# Altium schematic sheet SmartHome V3.SchDoc
size A2
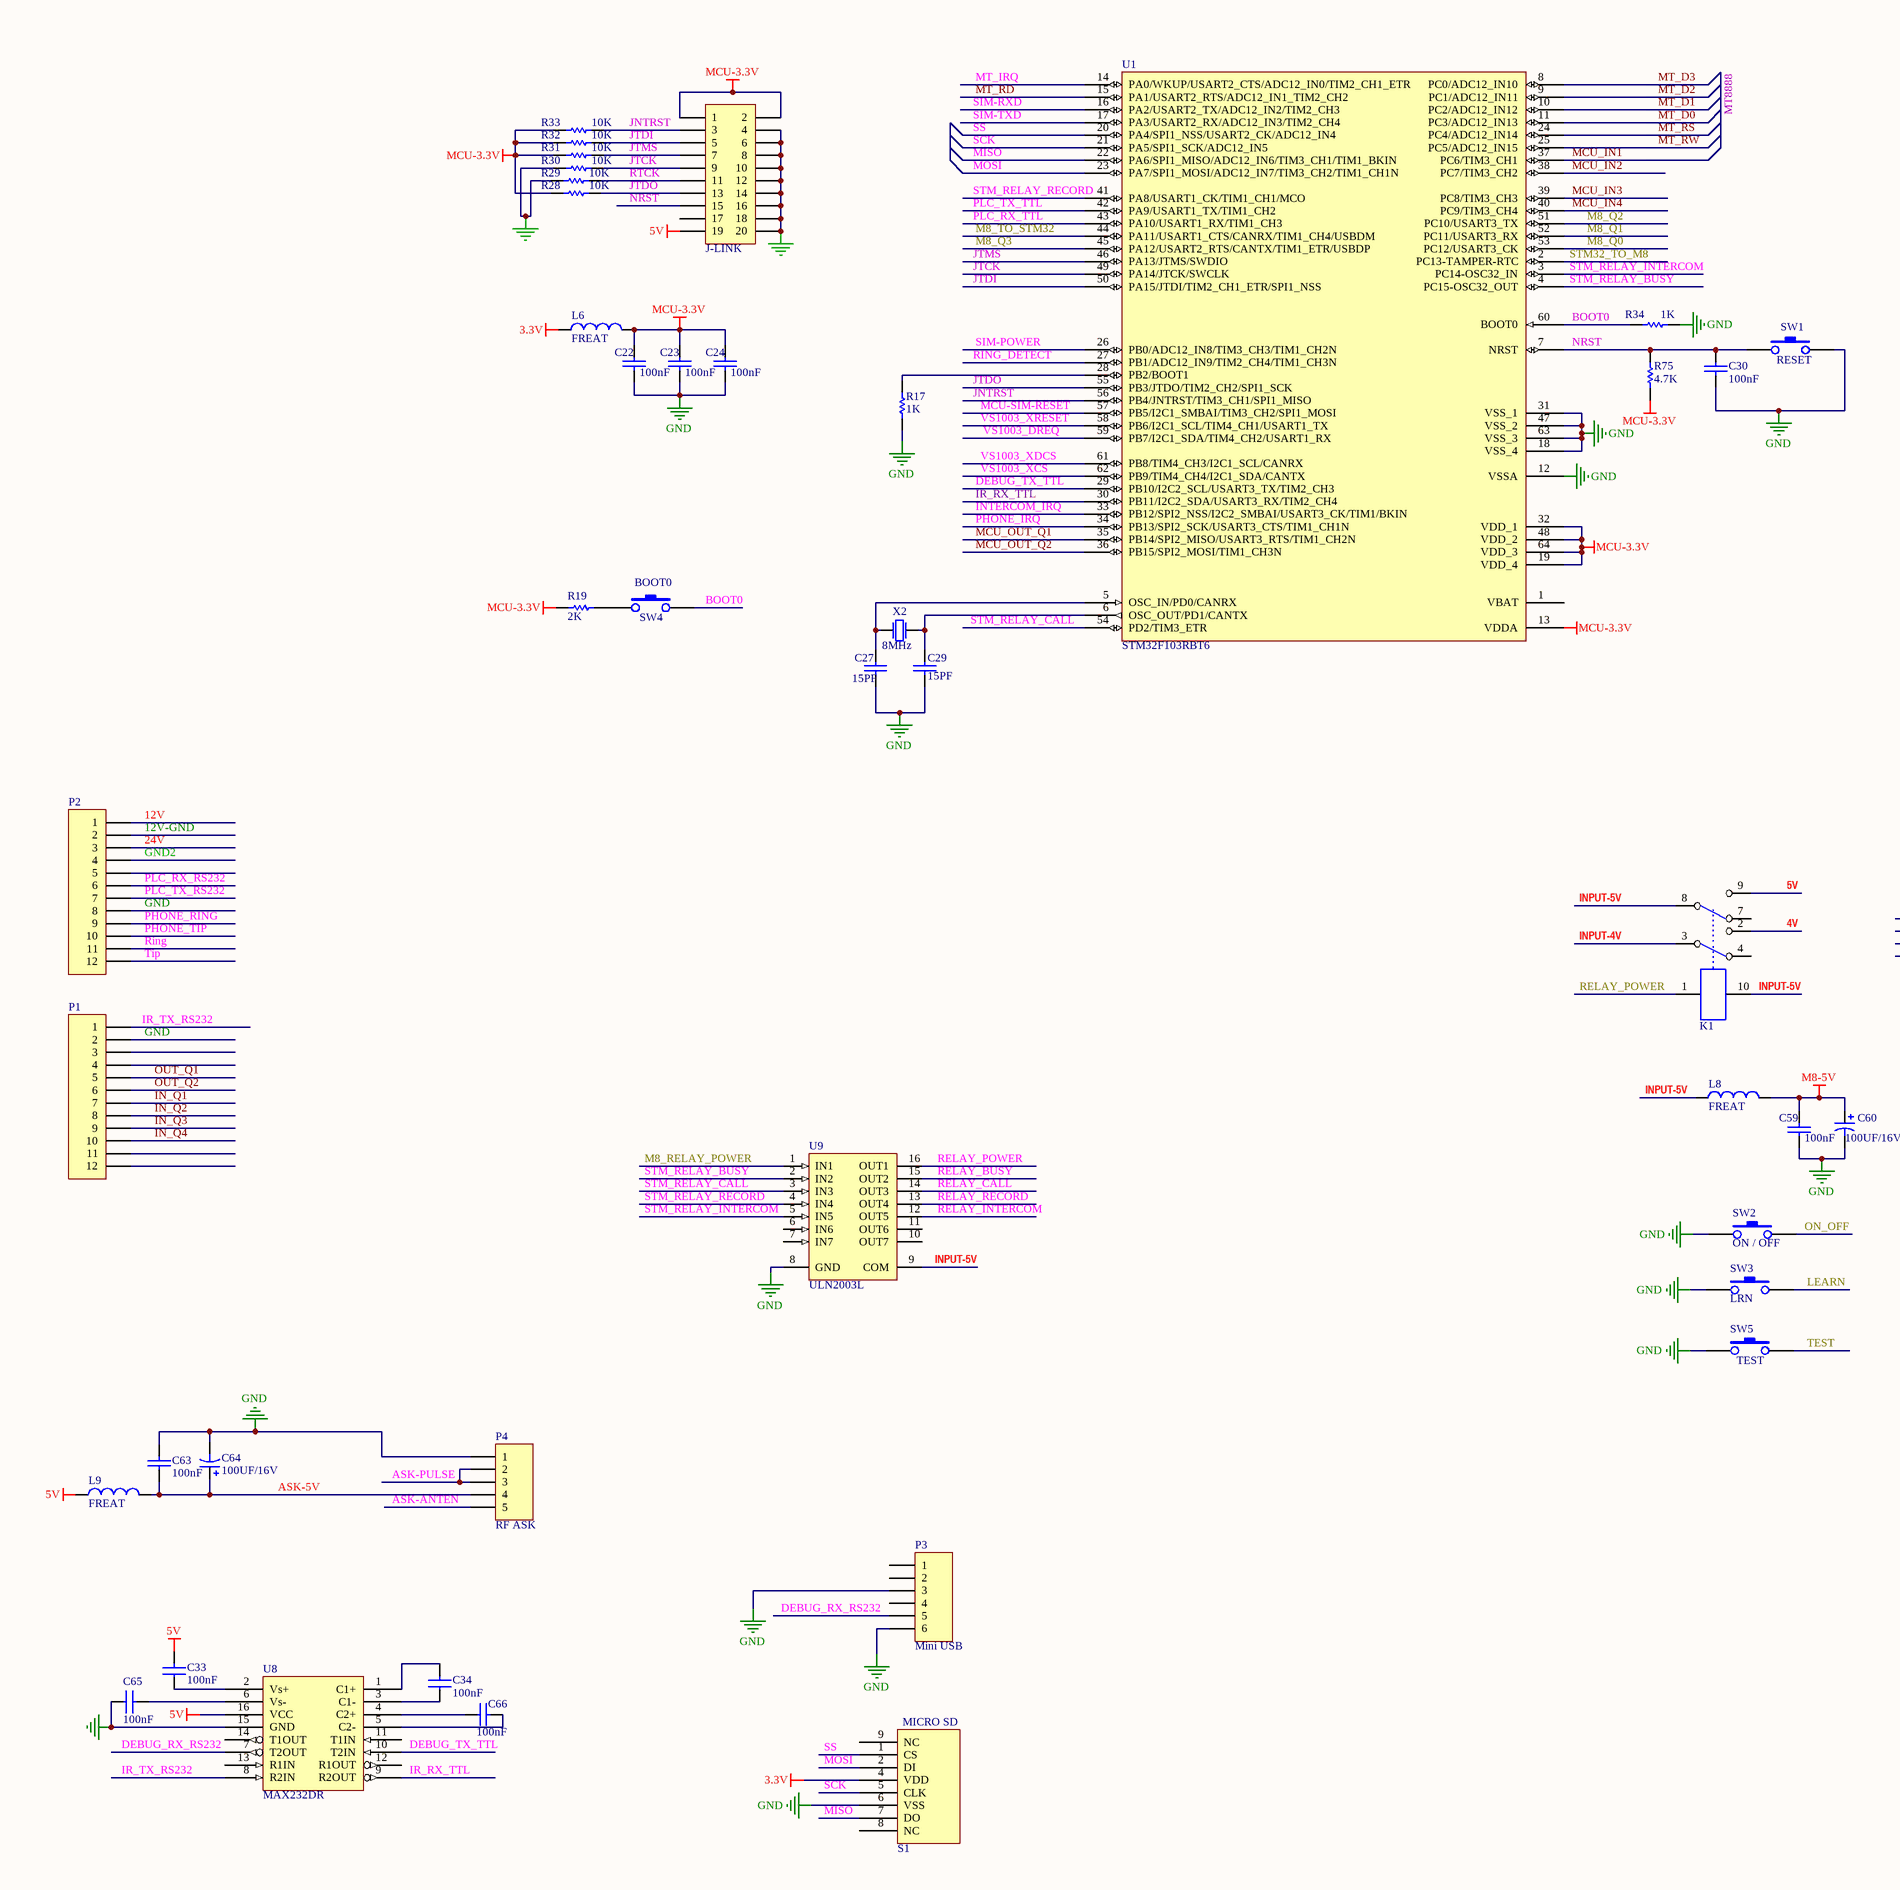
[diagram p0: SmartHome V3.SchDoc, left]
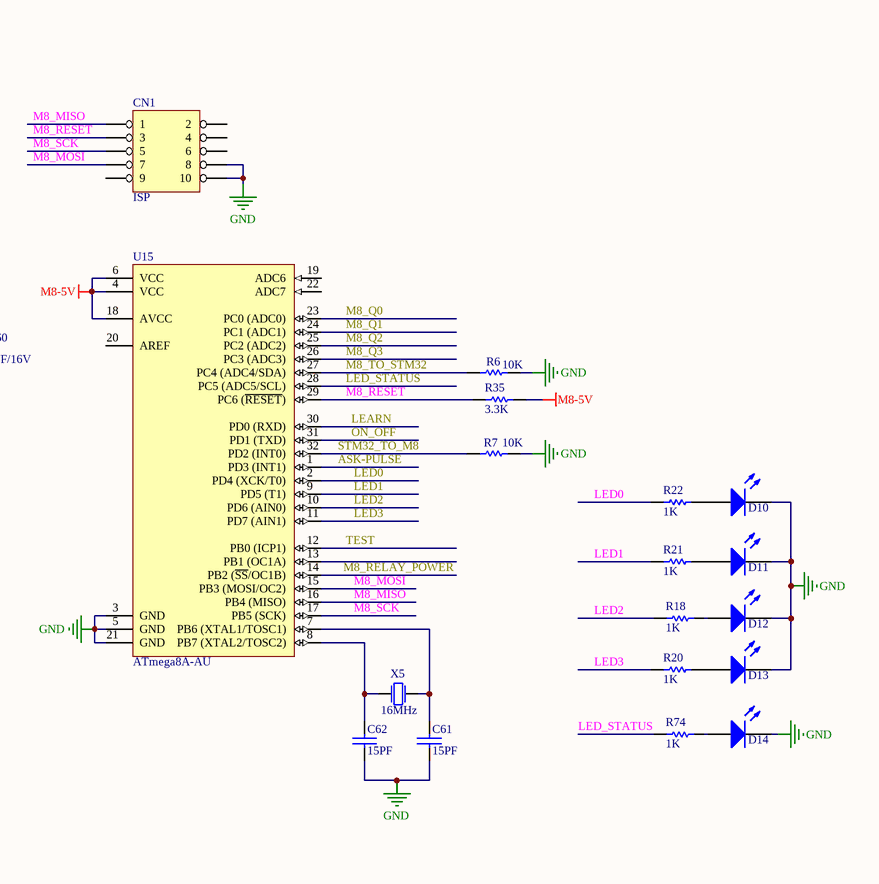
[diagram p1: SmartHome V3.SchDoc, right]

## Parts
C22  100nF  [0805C]
C23  100nF  [0805C]
C24  100nF  [0805C]
C27  15PF  [0805c]
C29  15PF  [0805c]
C30  100nF  [0805C]
C33  100nF  [0805C]
C34  100nF  [0805c]
C59  100nF  [0805C]
C60  value 100UF/16V  [100UF-SMD]  (hidden comment: 100uF / 16V SMD)
C61  15PF  [0805c]
C62  15PF  [0805c]
C63  100nF  [0805C]
C64  value 100UF/16V  [100UF-SMD]  (hidden comment: 100uF / 16V SMD)
C65  100nF  [0805c]
C66  100nF  [0805c]
CN1  ISP  [IDC2.54-V10D]
D10  LED  [0805D]  (value not drawn)
D11  LED  [0805D]  (value not drawn)
D12  LED  [0805D]  (value not drawn)
D13  LED  [0805D]  (value not drawn)
D14  LED  [0805D]  (value not drawn)
J-LINK  IDC 20  [IDC2.54-V20D]  (value not drawn)
K1  RELAY 5V  [RELAY G6H]  (value not drawn)
L6  FREAT  [1206]
L8  FREAT  [1206]
L9  FREAT  [1206]
P1  FONIX-12  [Fonit_Conector]  (value not drawn)
P2  FONIX-12  [Fonit_Conector]  (value not drawn)
P3  Mini USB  [miniusb]
P4  RF ASK  [ASK-RF]
R6  10K  [0805]
R7  10K  [0805]
R17  value 1K  [0805]  (hidden comment: 10K)
R18  1K  [0805]
R19  value 2K  [0805]  (hidden comment: 10K)
R20  1K  [0805]
R21  1K  [0805]
R22  1K  [0805]
R28  10K  [0805]
R29  10K  [0805]
R30  10K  [0805]
R31  10K  [0805]
R32  10K  [0805]
R33  10K  [0805]
R34  1K  [0805]
R35  3.3K  [0805]
R74  1K  [0805]
R75  4.7K  [0805]
S1  MICRO SD  [MicroSD]
SW1  SWITCH  [SWICH]  (value not drawn)
SW2  SWITCH  [SWICH]  (value not drawn)
SW3  SWITCH  [SWICH]  (value not drawn)
SW4  SWITCH  [SWICH]  (value not drawn)
SW5  SWITCH  [SWICH]  (value not drawn)
U1  STM32F103RBT6  [LQFP64_L]
U8  MAX232DR  [L16_N]
U9  ULN2003L  [L16_N]
U15  ATmega8A-AU  [32A_N]
X2  8MHz  [crystal]
X5  16MHz  [crystal]

## Nets
3.3V: L6.2 S1.4(VDD)
5V: C33.2 J-LINK.19 K1.9(NO2) L9.1 U8.16(VCC)
GND: C22.2 C23.2 C24.2 C27.2 C29.2 C30.2 C59.2 C60.2 C61.2 C62.2 C63.2 C64.2 C65.1 CN1.8 CN1.10 D10.2(K) D11.2(K) D12.2(K) D13.2(K) D14.2(K) J-LINK.4 J-LINK.6 J-LINK.8 J-LINK.10 J-LINK.12 J-LINK.14 J-LINK.16 J-LINK.18 J-LINK.20 P1.2 P2.8 P3.3 P3.6 P4.1 R6.2 R7.2 R17.1 R29.2 R30.2 R34.2 S1.6(VSS) SW1.2 SW2.2 SW3.2 SW5.2 U1.12(VSSA) U1.18(VSS_4) U1.31(VSS_1) U1.47(VSS_2) U1.63(VSS_3) U8.15(GND) U9.8(GND) U15.3(GND) U15.5(GND) U15.21(GND)
M8-5V: C59.1 C60.1 L8.1 R35.2 U15.4(VCC) U15.6(VCC) U15.18(AVCC)
MCU-3.3V: C22.1 C23.1 C24.1 J-LINK.1 J-LINK.2 L6.1 R19.2 R28.2 R31.2 R32.2 R33.2 R75.2 U1.13(VDDA) U1.19(VDD_4) U1.32(VDD_1) U1.48(VDD_2) U1.64(VDD_3)
4V: K1.2(NO1)
12V: P2.1
12V-GND: P2.2
24V: P2.3
ASK-5V: C63.1 C64.1 L9.2 P4.4
ASK-ANTEN: P4.5
ASK-PULSE: P4.2 P4.3 U15.1(PD3_(INT1))
BOOT0: R34.1 SW4.1 U1.60(BOOT0)
DEBUG_RX_RS232: P3.5 U8.7(T2OUT)
DEBUG_TX_TTL: U1.29(PB10/I2C2_SCL/USART3_TX/TIM2_CH3) U8.10(T2IN)
GND2: P2.4
IN_Q1: P1.7
IN_Q2: P1.8
IN_Q3: P1.9
IN_Q4: P1.10
INPUT-4V: K1.3(C1)
INPUT-5V: K1.8(C2) K1.10(-) L8.2 U9.9(COM)
INTERCOM_IRQ: U1.33(PB12/SPI2_NSS/I2C2_SMBAI/USART3_CK/TIM1/BKIN)
IR_RX_TTL: U1.30(PB11/I2C2_SDA/USART3_RX/TIM2_CH4) U8.9(R2OUT)
IR_TX_RS232: P1.1 U8.8(R2IN)
JNTRST: J-LINK.3 R33.1 U1.56(PB4/JNTRST/TIM3_CH1/SPI1_MISO)
JTCK: J-LINK.9 R30.1 U1.49(PA14/JTCK/SWCLK)
JTDI: J-LINK.5 R32.1 U1.50(PA15/JTDI/TIM2_CH1_ETR/SPI1_NSS)
JTDO: J-LINK.13 R28.1 U1.55(PB3/JTDO/TIM2_CH2/SPI1_SCK)
JTMS: J-LINK.7 R31.1 U1.46(PA13/JTMS/SWDIO)
LEARN: SW3.1 U15.30(PD0_(RXD))
LED0: R22.1 U15.2(PD4_(XCK/T0))
LED1: R21.1 U15.9(PD5_(T1))
LED2: R18.1 U15.10(PD6_(AIN0))
LED3: R20.1 U15.11(PD7_(AIN1))
LED_STATUS: R74.1 U15.28(PC5_(ADC5/SCL))
M8_MISO: CN1.1 U15.16(PB4_(MISO))
M8_MOSI: CN1.7 U15.15(PB3_(MOSI/OC2))
M8_Q0: U1.53(PC12/USART3_CK) U15.23(PC0_(ADC0))
M8_Q1: U1.52(PC11/USART3_RX) U15.24(PC1_(ADC1))
M8_Q2: U1.51(PC10/USART3_TX) U15.25(PC2_(ADC2))
M8_Q3: U1.45(PA12/USART2_RTS/CANTX/TIM1_ETR/USBDP) U15.26(PC3_(ADC3))
M8_RELAY_POWER: U9.1(IN1) U15.14(PB2_(~{SS}/OC1B))
M8_RESET: CN1.3 R35.1 U15.29(PC6_(~{RESET}))
M8_SCK: CN1.5 U15.17(PB5_(SCK))
M8_TO_STM32: R6.1 U1.44(PA11/USART1_CTS/CANRX/TIM1_CH4/USBDM) U15.27(PC4_(ADC4/SDA))
MCU-SIM-RESET: U1.57(PB5/I2C1_SMBAI/TIM3_CH2/SPI1_MOSI)
MCU_IN1: U1.37(PC6/TIM3_CH1)
MCU_IN2: U1.38(PC7/TIM3_CH2)
MCU_IN3: U1.39(PC8/TIM3_CH3)
MCU_IN4: U1.40(PC9/TIM3_CH4)
MCU_OUT_Q1: U1.35(PB14/SPI2_MISO/USART3_RTS/TIM1_CH2N)
MCU_OUT_Q2: U1.36(PB15/SPI2_MOSI/TIM1_CH3N)
MISO: S1.7(DO) U1.22(PA6/SPI1_MISO/ADC12_IN6/TIM3_CH1/TIM1_BKIN)
MOSI: S1.2(DI) U1.23(PA7/SPI1_MOSI/ADC12_IN7/TIM3_CH2/TIM1_CH1N)
MT_D0: U1.11(PC3/ADC12_IN13)
MT_D1: U1.10(PC2/ADC12_IN12)
MT_D2: U1.9(PC1/ADC12_IN11)
MT_D3: U1.8(PC0/ADC12_IN10)
MT_IRQ: U1.14(PA0/WKUP/USART2_CTS/ADC12_IN0/TIM2_CH1_ETR)
MT_RD: U1.15(PA1/USART2_RTS/ADC12_IN1_TIM2_CH2)
MT_RS: U1.24(PC4/ADC12_IN14)
MT_RW: U1.25(PC5/ADC12_IN15)
NRST: C30.1 J-LINK.15 R75.1 SW1.1 U1.7(NRST)
ON_OFF: SW2.1 U15.31(PD1_(TXD))
OUT_Q1: P1.5
OUT_Q2: P1.6
PHONE_IRQ: U1.34(PB13/SPI2_SCK/USART3_CTS/TIM1_CH1N)
PHONE_RING: P2.9
PHONE_TIP: P2.10
PLC_RX_RS232: P2.6
PLC_RX_TTL: U1.43(PA10/USART1_RX/TIM1_CH3)
PLC_TX_RS232: P2.7
PLC_TX_TTL: U1.42(PA9/USART1_TX/TIM1_CH2)
RELAY_BUSY: U9.15(OUT2)
RELAY_CALL: U9.14(OUT3)
RELAY_INTERCOM: U9.12(OUT5)
RELAY_POWER: K1.1(+) U9.16(OUT1)
RELAY_RECORD: U9.13(OUT4)
Ring: P2.11
RING_DETECT: U1.27(PB1/ADC12_IN9/TIM2_CH4/TIM1_CH3N)
RTCK: J-LINK.11 R29.1
SCK: S1.5(CLK) U1.21(PA5/SPI1_SCK/ADC12_IN5)
SIM-POWER: U1.26(PB0/ADC12_IN8/TIM3_CH3/TIM1_CH2N)
SIM-RXD: U1.16(PA2/USART2_TX/ADC12_IN2/TIM2_CH3)
SIM-TXD: U1.17(PA3/USART2_RX/ADC12_IN3/TIM2_CH4)
SS: S1.1(CS) U1.20(PA4/SPI1_NSS/USART2_CK/ADC12_IN4)
STM32_TO_M8: R7.1 U1.2(PC13-TAMPER-RTC) U15.32(PD2_(INT0))
STM_RELAY_BUSY: U1.4(PC15-OSC32_OUT) U9.2(IN2)
STM_RELAY_CALL: U1.54(PD2/TIM3_ETR) U9.3(IN3)
STM_RELAY_INTERCOM: U1.3(PC14-OSC32_IN) U9.5(IN5)
STM_RELAY_RECORD: U1.41(PA8/USART1_CK/TIM1_CH1/MCO) U9.4(IN4)
TEST: SW5.1 U15.12(PB0_(ICP1))
Tip: P2.12
VS1003_DREQ: U1.59(PB7/I2C1_SDA/TIM4_CH2/USART1_RX)
VS1003_XCS: U1.62(PB9/TIM4_CH4/I2C1_SDA/CANTX)
VS1003_XDCS: U1.61(PB8/TIM4_CH3/I2C1_SCL/CANRX)
VS1003_XRESET: U1.58(PB6/I2C1_SCL/TIM4_CH1/USART1_TX)
NetC27_1: C27.1 U1.5(OSC_IN/PD0/CANRX) X2.2(P2)
NetC29_1: C29.1 U1.6(OSC_OUT/PD1/CANTX) X2.1(P1)
NetC33_1: C33.1 U8.2(Vs+)
NetC34_1: C34.1 U8.3(C1-)
NetC34_2: C34.2 U8.1(C1+)
NetC61_1: C61.1 U15.7(PB6_(XTAL1/TOSC1)) X5.1(P1)
NetC62_1: C62.1 U15.8(PB7_(XTAL2/TOSC2)) X5.2(P2)
NetC65_2: C65.2 U8.6(Vs-)
NetC66_1: C66.1 U8.4(C2+)
NetC66_2: C66.2 U8.5(C2-)
NetD10_1: D10.1(A) R22.2
NetD11_1: D11.1(A) R21.2
NetD12_1: D12.1(A) R18.2
NetD13_1: D13.1(A) R20.2
NetD14_1: D14.1(A) R74.2
NetR17_2: R17.2 U1.28(PB2/BOOT1)
NetR19_1: R19.1 SW4.2

Not connected (* = marked no-connect by the designer): CN1 2 4 6 9; J-LINK 17; K1 4(NC1) 7(NC2); P1 3 4 11 12; P2 5; P3 1 2 4; S1 8(NC) 9(NC); U1 1(VBAT); U8 11(T1IN) 12(R1OUT) 13(R1IN) 14(T1OUT); U9 6(IN6) 7(IN7) 10(OUT7) 11(OUT6); U15 13(PB1_(OC1A)) 19(ADC6) 20(AREF) 22(ADC7)

## Buses and harness runs
bus MT8888

## Notes on the sheet
- (in symbol SW-PB) RESET; BOOT0; LRN; ON / OFF; TEST

## Library data of the parts
C22-C24 C59 C63 = CAP
C27 C29 C61 C62 = CAP: Capacitor; Section Code: 12103412
C30 = CAP: Capacitor; Section Code: 12123895
C33 C34 C65 C66 = CAP NP: Part Field 1: CS; Section Code: 12103465; Part Field 2: 0603; Part Field 3: 20V
C60 C64 = Cap Pol1: Polarized Capacitor (Radial)
CN1 = HEADER 5X2: Section Code: 30101139
D10-D14 = LED3: Typical BLUE SiC LED; Published: 8-Jun-2000; LatestRevisionDate: 17-Dec-2003; LatestRevisionNote: PCB Footprint replaced.; DatasheetVersion: 16-Apr-2002; PackageVersion: 16-Apr-2002; PackageReference: 3.5X2.8X1.9; Publisher: Altium Limited; PackageDescription: SM LED; 2 C-Bend Leads; Body 3.5 x 2.8 x 1.9 mm, inc leads (LxWxH typ)
J-LINK = Header 10X2: Header, 10-Pin, Dual row; E: 30101131; LatestRevisionDate: 17-Jul-2002; LatestRevisionNote: Re-released for DXP Platform.; Publisher: Altium Limited; Published: 12103757
K1 = RELAY DPDT-G6HU
L6 L8 L9 = Inductor: Code_IEC: 1005; Value: 250mA; Published: 8-Jun-2000; LatestRevisionDate: 29-May-2009; LatestRevisionNote: IPC-7351 Footprint Added.; PackageReference: 0402-A; Publisher: Altium Limited; PackageDescription: Chip Inductor; Code_JEITA: 0402
P1 P2 = Header 12: Header, 12-Pin; LatestRevisionDate: 17-Jul-2002; LatestRevisionNote: Re-released for DXP Platform.; Publisher: Altium Limited
P3 P4 = Header 5: Header, 5-Pin; LatestRevisionDate: 17-Jul-2002; LatestRevisionNote: Re-released for DXP Platform.
  P3: Publisher: DEBUGGER
  P4: Publisher: Altium Limited
R6 R7 R17 R19 R34 R35 R75 = Res Semi: Semiconductor Resistor; Published: 8-Jun-2000; LatestRevisionDate: 17-Jul-2002; LatestRevisionNote: Re-released for DXP Platform.; PackageReference: AXIAL-0.5; Publisher: Altium Limited; PackageDescription: Axial Device, Thru-Hole; 2 Leads; 0.5 in Pin Spacing
  R6 R7: Value: 10K
  R34: Value: 1K
  R35: Value: 3.3K
  R75: Value: 4.7K
R18 R20-R22 R74 = Res1: Resistor; Published: 8-Jun-2000; Revision: July-2002: Re-released for DXP Platform.; Publisher: Altium Limited; Value: 1K
R28-R33 = Res1: Resistor; E: 11113371; Published: 12103465; LatestRevisionDate: 17-Jul-2002; LatestRevisionNote: Re-released for DXP Platform.; PackageReference: AXIAL-0.3; Publisher: Altium Limited; Value: 10K
S1 = Component_1_1
SW1-SW5 = SW-PB: Section Code: 20106004
U1 = STM32F103RBT6: STM32 ARM-based 32-bit MCU with 128 Kbytes Flash, 64-pin LQFP, Industrial Temperature; Published: 30-May-2008; DatasheetVersion: rev6, Mar-2008; PackageVersion: Mar-2008; PackageReference: LQFP64; Publisher: Altium Limited; PackageDescription: 64-Pin Low-Profile Quad Flat Pack, 10 x 10 mm Body, 0.5 mm Pitch (LQFP64); ComponentLink1Description: Manufacturer Link; ComponentLink1URL: www.st.com/stm32; ComponentLink2Description: Datasheet; ComponentLink2URL: http://www.st.com/stonline/products/literature/ds/13587.pdf
U8 = MAX232: DUAL EIA-232 DRIVER/RECEIVER; Part Field 1: US; Section Code: 14203714; Part Field 2: SOL-16
U9 = ULN2003L: High-Voltage, High-Current Darlington Array; Published: 13-Oct-2000; LatestRevisionDate: 13-Apr-2006; LatestRevisionNote: IPC-7351 Footprint Added.; DatasheetVersion: 1998; PackageReference: L16; Publisher: Altium Limited; PackageDescription: 16-Pin Small Outline Integrated Circuit 1.27 mm Pitch; Code_JEDEC: MS-012-AC; Code_IPC: SOIC127P600-16; ComponentLink1Description: Manufacturer Link; ComponentLink1URL: http://www.allegromicro.com/
U15 = ATmega8A-AU: 8-bit AVR Microcontroller, 8KB Flash, 512 Bytes EEPROM, 1KB SRAM, 32-pin TQFP, Industrial Grade (-40°C to 85°C); Published: 1-Apr-2010; DatasheetVersion: revC, Jul-2009; PackageVersion: revB, Oct-2001; PackageReference: 32A; Publisher: Altium Limited; PackageDescription: 32-Lead, 7x7x1.0 mm Body, 0.8mm Lead Pitch, Thin Profile Plastic Quad Flat Package (TQFP); Supplier 1: Digi-Key; Supplier Part Number 1: ATMEGA8A-AU-ND; Supplier 2: Farnell; Supplier Part Number 2: 1748532; Supplier 3: Mouser; Supplier Part Number 3: 556-ATMEGA8A-AU; Code_JEDEC: MS-026-ABA; ComponentLink1Description: Manufacturer Link; ComponentLink1URL: http://www.atmel.com/products/avr/default.asp?; ComponentLink2Description: ATmega8A Datasheet; ComponentLink2URL: http://www.atmel.com/dyn/resources/prod_documents/doc8159.pdf; ComponentLink3Description: ATmega8A Summary; ComponentLink3URL: http://www.atmel.com/dyn/resources/prod_documents/8159S.pdf; ComponentLink4Description: Atmel.com Home; ComponentLink4URL: http://www.atmel.com
X2 X5 = 16.000MHZ: Crystal Oscillator; Section Code: 18201307; Part Field 2: HC49; Part Field 4: 1ppm